# Altium schematic sheet Power.SchDoc: POWER
size A4; SheetNumber: 2; SheetTotal: 5
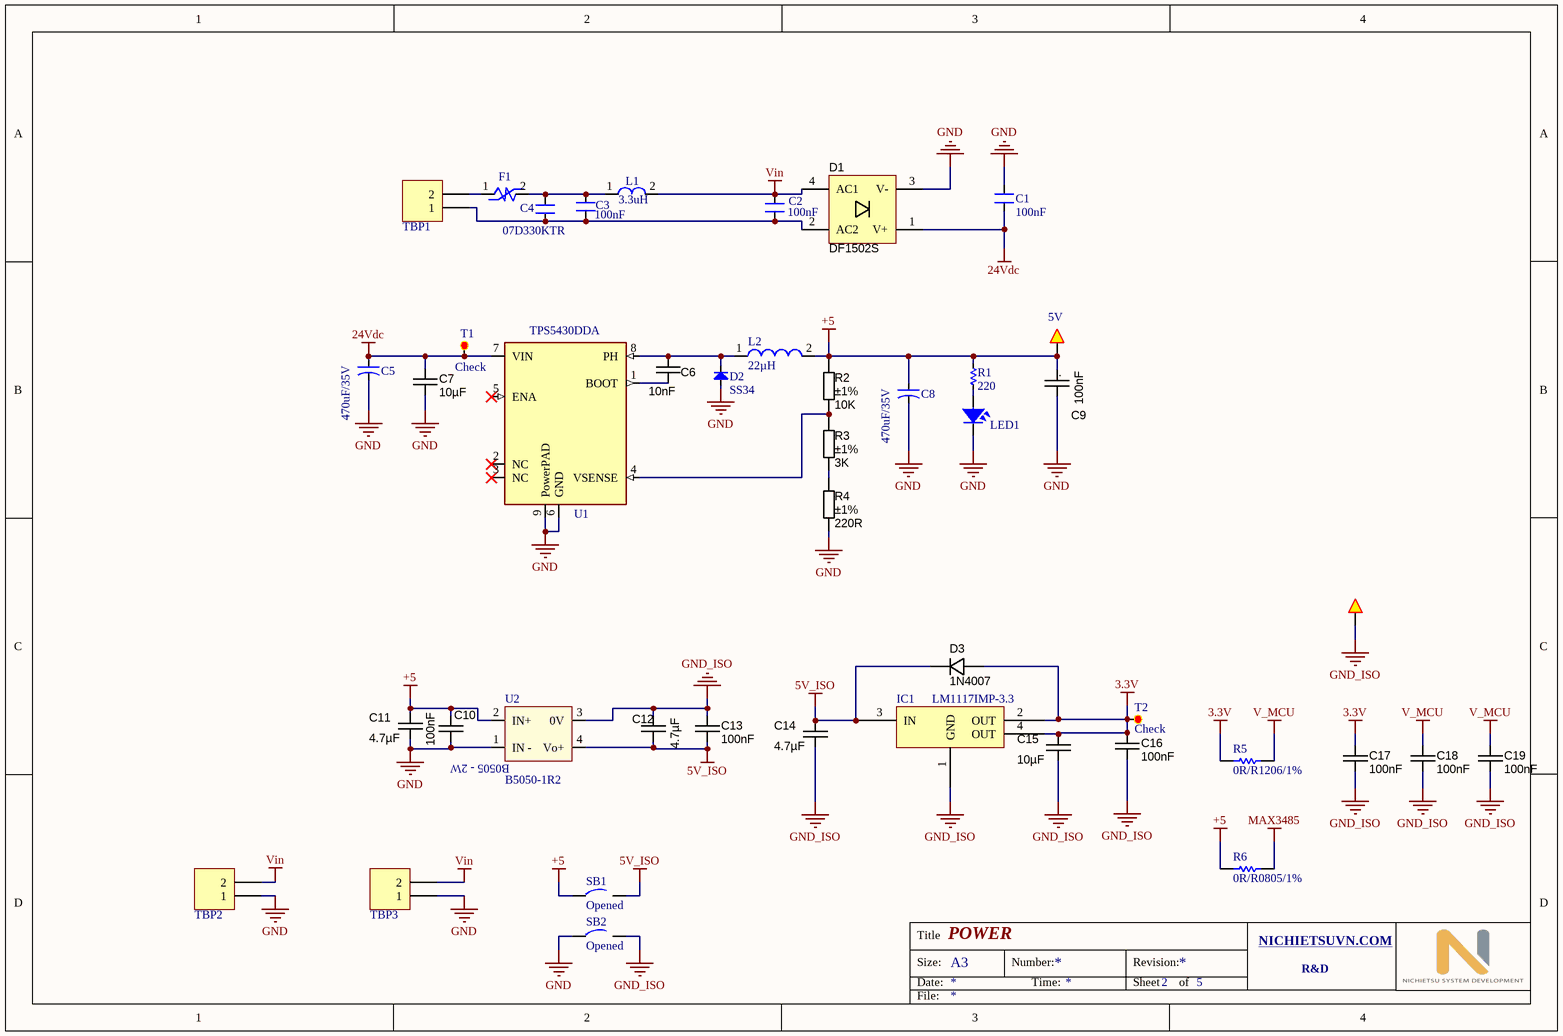
[diagram p0: Power.SchDoc]

## Parts
B1  TX1  [Test]  (value not drawn)
C1  100nF  [CN-SMD-1206]
C2  100nF  [CN-SMD-1206]
C3  100nF  [CN2.5]
C4  07D330KTR  [CN2-T]
C5  470uF/35V  [CA-ALU-6.3]
C6  10nF  [CAPC1608X90N]
C7  10µF  [CAPC2012X135N]
C8  470uF/35V  [CA-ALU-6.3]
C9  100nF  [CAPC2012X135N]
C10  100nF  [CAPC1608X90N]
C11  4.7µF  [CAPC2012X135N]
C12  4.7µF  [CAPC2012X135N]
C13  100nF  [CAPC1608X90N]
C14  4.7µF  [CAPC2012X135N]
C15  10µF  [CAPC2012X135N]
C16  100nF  [CAPC1608X90N]
C17  100nF  [CAPC1608X90N]
C18  100nF  [CAPC1608X90N]
C19  100nF  [CAPC1608X90N]
Check1  5V  [SMD-2]
D1  DF1502S  [DIODE_DF_S]
D2  SS34  [DIO-SMD-106]
D3  1N4007  [DO-214AC]
F1  RUEF185  [RUEF165]  (value not drawn)
IC1  LM1117IMP-3.3  [SOT223]
L1  3.3uH  [L-SMD-M-7.3x4.5]
L2  22µH  [IND_COIL_8D43]
LED1  LED  [LED-0805-Blue]  (value not drawn)
R1  220  [RES-SMD-0603]
R2  value 10K  Tolerance: ±1%  [RESC1608X55N]  (hidden comment: 10K_0603_1%)
R3  value 3K  Tolerance: ±1%  [RESC1608X55N]  (hidden comment: 3K_0603_0.5%)
R4  value 220R  Tolerance: ±1%  [RESC1608X55N]  (hidden comment: 220R_0603_1%)
R5  0R/R1206/1%  [R1206]
R6  0R/R0805/1%  [R0805]
SB1  Opened  [SB_0603]
SB2  Opened  [SB_0603]
T1  Check  [SMD_1.5]
T2  Check  [SMD_1.5]
TBP1  WE-Terminal Blocks Plugable Type 691322310002  [Terminal_Blocks_Pluggable_Socket__Right_Angle__3.81_mm_Pitch__2_Position]  (value not drawn)
TBP2  WE-Terminal Blocks Plugable Type 691322310002  [Terminal_Blocks_Pluggable_Socket__Right_Angle__3.81_mm_Pitch__2_Position]  (value not drawn)
TBP3  WE-Terminal Blocks Plugable Type 691322310002  [Terminal_Blocks_Pluggable_Socket__Right_Angle__3.81_mm_Pitch__2_Position]  (value not drawn)
U1  TPS5430DDA  [TPS5430]
U2  B5050-1R2  [B0505_1W]

## Nets
3.3V: C15.2 C16.1 C17.1 D3.A IC1.2(OUT) IC1.4(OUT) R5.1 T2.1
5V_ISO: C12.1 C13.2 C14.2 D3.C IC1.3(IN) SB1.2 U2.4(Vo+)
24Vdc: C1.2 C5.1 C7.2 D1.1(V+) T1.1 U1.7(VIN)
+5: C8.1 C9.1 C10.1 C11.2 Check1.1 L2.2 R1.1 R2.2 R6.1 SB1.1 U2.2(IN+)
GND: C1.1 C5.2 C7.1 C8.2 C9.2 C10.2 C11.1 D1.3(V-) D2.1(A) LED1.2 R4.1 SB2.1 TBP2.1 TBP3.1 U1.6(GND) U1.9(PowerPAD) U2.1(IN_-)
GND_ISO: B1.1 C12.2 C13.1 C14.1 C15.1 C16.2 C17.2 C18.2 C19.2 IC1.1(GND) SB2.2 U2.3(0V)
MAX3485: R6.2
V_MCU: C18.1 C19.1 R5.2
Vin: C2.2 D1.4(AC1) L1.2 TBP2.2 TBP3.2
NetC2_1: C2.1 C3.1 C4.1 D1.2(AC2) TBP1.1
NetC3_2: C3.2 C4.2 F1.2 L1.1
NetC6_1: C6.1 U1.1(BOOT)
NetC6_2: C6.2 D2.2(K) L2.1 U1.8(PH)
NetF1_1: F1.1 TBP1.2
NetLED1_1: LED1.1 R1.2
NetR2_1: R2.1 R3.2 U1.4(VSENSE)
NetR3_1: R3.1 R4.2

Not connected (* = marked no-connect by the designer): U1 2(NC)* 3(NC)* 5(ENA)*

## Notes on the sheet
- Title
- Size:
- Date:
- A3
- Number:
- Time:
- Revision:
- Sheet
- of
- NICHIETSUVN.COM <http://NICHIETSUVN.COM>
- R&D
- File:
- (in symbol B5050-1W) B0505 - 2W
- (in symbol CAPC_100nF_0805_X7R_50V_10%) .

## Library data of the parts
B1 Check1 T1 T2 = Test: WR-PHD 2.54 mm Angled Socket Header; Manufacturer: W¨¹rth Elektronik eiSos GmbH; partNo: 613002143121; ComponentLink1 Description: Manufacturer; ComponentLink2 Description: Datasheet; NoPins: 02; Created Date: 29 March 2013; ComponentLink1URL: http://www.we-online.com; ComponentLink2URL: http://katalog.we-online.de/em/datasheet/6130xx143121.pdf; Created by: Karrer Zheng
C1-C4 = CN: Value: 33pF
C5 C8 = CN-ALU-DIP: Capacitor (Semiconductor SIM Model); Value: 104; LatestRevisionDate: 17-Jul-2002; LatestRevisionNote: Re-released for DXP Platform.; PackageReference: C1206; Publisher: Altium Limited
C6 = CAPC_10000pF_0603_50V_10%: 10000pF ±10% 50V Ceramic Capacitor X7R 0603 (1608 Metric); Manufacturer 1: TDK Corporation; Manufacturer Part Number 1: CGA3E2X7R1H103K080AA; Pcs 2: 10; Tolerance: ±10%; Operating Temperature: -55°C ~ 125°C; Package / Case: 0603 (1608 Metric); Voltage - Rated: 50V; Ratings: AEC-Q200; Temperature Coefficient: X7R; Supplier Part Number 1: 445-5662-6-ND; Supplier 1: Digi-Key; Supplier 2: https://www.thegioiic.com; Supplier Part Number 2: https://www.thegioiic.com/products/tu-gom-0603-10nf-50v; Price 2: 1900; Value: 10nF
C7 = CAPC_10uF_0805_X7R_25V_10%: 10µF ±10% 25V Ceramic Capacitor X7R 1206 (3216 Metric); Manufacturer 1: Taiyo Yuden; Manufacturer Part Number: TMK316AB7106KLHT; Pcs 2: 10; Supplier 1: Digi-Key; Supplier Part Number 1: 587-3485-6-ND; Tolerance: ±10%; Operating Temperature: -55°C ~ 125°C; Package / Case: 0805 (2012 metric); Voltage - Rated: 25V; Ratings: AEC-Q200; Temperature Coefficient: X7R; Supplier 2: https://www.thegioiic.com; Supplier Part Number 2: https://www.thegioiic.com/products/tu-gom-0805-10uf-25v; Price 2: 5800; Value: 10µF
C9 = CAPC_100nF_0805_X7R_50V_10%: 0.1µF ±10% 50V Ceramic Capacitor X7R 0805 (2012 Metric); Manufacturer 1: Samsung Electro-Mechanics; Manufacturer Part Number: CL21B104KBFXPJE; Pcs 2: 10; Supplier 1: Digi-Key; Supplier Part Number 1: 1276-CL21B104KBFXPJEDKR-ND; Tolerance: ±10%; Operating Temperature: -55°C ~ 125°C; Package / Case: 0805 (2012 metric); Voltage - Rated: 50V; Ratings: AEC-Q200; Temperature Coefficient: X7R; Price 2: 2000; Supplier 2: https://www.thegioiic.com; Supplier Part Number 2: https://www.thegioiic.com/products/tu-gom-0805-100nf-0-1uf-50v; Value: 100nF
C10 C13 C16-C19 = CAPC_100nF_0603_X7R_50V_10%: 0.1µF ±10% 50V Ceramic Capacitor X7R 0603 (1608 Metric); Manufacturer 1: TDK Corporation; Manufacturer Part Number 1: CGA3E2X7R1H104K080AA; Pcs 2: 10; Supplier 1: Digi-Key; Supplier Part Number 1: 445-5666-6-ND; Tolerance: ±10%; Operating Temperature: -55°C ~ 125°C; Package / Case: 0603 (1608 Metric); Voltage - Rated: 50V; Ratings: AEC-Q200; Temperature Coefficient: X7R; Applications: Automotive; Packaging: Digi-Reel®; Supplier 2: www.thegioiic.com; Supplier Part Number 2: https://www.thegioiic.com/products/tu-gom-0603-100nf-0-1uf-50v; Price 2: 1800; Value: 100nF
C11 C12 C14 C15 = CAPC_4.7uF_0805_X7R_50V_10%: 4.7µF ±10% 50V Ceramic Capacitor X7R 0805 (2012 Metric); Manufacturer 1: TDK Corporation; Manufacturer Part Number: CGA4J1X7R1H475K125AE; Pcs 2: 1; Package / Case: 0805 (2012 metric); Tolerance: ±10%; Voltage - Rated: 50V; Temperature Coefficient: X7R; Ratings: AEC-Q200; Operating Temperature: -55°C ~ 125°C; Supplier 1: Digi-Key; Supplier Part Number 1: 445-181410-6-ND; Supplier 2: https://www.thegioiic.com; Supplier Part Number 2: https://www.thegioiic.com/products/tu-gom-0805-4-7uf-50v; Price 2: 680
  C11 C12 C14: Value: 4.7µF
  C15: Value: 10µF
D1 = DIODE_DF1502S: Bridge Rectifier Single Phase Standard 200V Surface Mount DF-S; Manufacturer 1: Diodes Incorporated; Manufacturer Part Number 1: DF1502S-T; Ratings: 200V; 1.5A; Pcs 2: 1; Package / Case: 4-SMD, Gull Wing; Diode Type: Standard; Mounting Type: Surface Mount; Supplier 1: Digi-Key; Supplier Part Number 1: DF1502SDIDKR-ND; Supplier 2: https://www.thegioiic.com; Supplier Part Number 2: https://www.thegioiic.com/products/df1502s-cau-chinh-luu-200v-1-5a; Price 2: 3500
D2 = Diode SMD: Default Diode; Code - JEDEC: DO-214-AB; Value: 1N5007; Published: 8-Jun-2000; Revision: July-2002: Re-released for DXP Platform.; Publisher: Altium Limited
D3 = DIODE_1N4007: Diode  Standard Rectifier SMD 1000V 1A SMA; Manufacturer 1: Micro Commercial Co; Manufacturer Part Number 1: SM4007PL-TP; Speed: Standard Recovery >500ns, > 200mA (Io); Ratings: 1000V; 1A; Pcs 2: 1; Package / Case: DO-214AC, SMA; Diode Type: Standard; Mounting Type: Surface Mount; Supplier 1: Digi-Key; Supplier Part Number 1: SM4007PL-TPMSDKR-ND; Supplier 2: https://www.thegioiic.com; Supplier Part Number 2: https://www.thegioiic.com/products/1n4007-m7-diode-chinh-luu-1a-1kv; Price 2: 1000
IC1 = IC_LM1117IMP-3.3: Linear Voltage Regulator IC  1 Output  800mA SOT-223; Manufacturer: Texas Instruments; Manufacturer Part Number: LM1117IMP-3.3/NOPB; Voltage - Input (Max): 15V; Voltage Dropout (Max): 1.2V @ 800mA; Protection Features: Over Current, Over Temperature; PSRR: 75dB (120Hz); Pcs 2: 1; Supplier 1: Digi-Key; Supplier Part Number 1: LM1117IMP-3.3/NOPBDKR-ND; Current - Output: 800mA; Operating Temperature: -40°C ~ 125°C; Price 2: 11000; Supplier Device Package: SOT-223; Supplier 2: https://www.thegioiic.com; Supplier Part Number 2: https://www.thegioiic.com/products/lm1117imp-3-3-nopb-ic-on-ap-3-3v-800ma
L1 = L-SMD-1: partNo: 78477010; Manufacturer: Wurth Elektronik; Inductance: 1.0 μH; ComponentLink1Description: Manufacturer; ComponentLink1URL: http://www.we-online.de; Created by: Baojun Chen; Created Date: Nov.2015; ComponentLink2Description: Datasheet; ComponentLink2URL: http://katalog.we-online.de/pbs/datasheet/78477010.pdf
L2 = INDC_SMD_22uH_8D43: 22µH Shielded Wirewound Inductor 950mA 380mOhm Max Nonstandard; Manufacturer 1: Yageo; Current Rating (Amps): 3.25 A; Ratings: None AEC-Q200; Pcs 2: 1; Supplier 1: Digi-Key; Operating Temperature: -40°C ~ 125°C; Value: 22µH; Supplier 2: https://www.thegioiic.com/; Supplier Part Number 2: https://www.thegioiic.com/products/cuon-cam-dan-smd-8d43-220-22uh-3-25a; Price 2: 2000
LED1 = LED SMD: Value: LED 3 - 5 ly 2 Colour
R1 = Res-SMD: Resistor; Manufacturer: Generic Components; Class: Passive; Published: 08/06/2000; Publisher: Altium Hobart Technology Centre
R2 = RES_10K_0603_1%: 10 kOhms ±1% 0.1W, 1/10W Chip Resistor 0603 (1608 Metric) Anti-Sulfur, Automotive AEC-Q200, Moisture Resistant Thin Film; Manufacturer: Stackpole Electronics Inc; Manufacturer Part Number: RMCF0603FT10K0; Temperature Coefficient: ±100ppm/°C; Pcs 2: 50; Package / Case: 0603 (1608 Metric); Power (Watts): 1/10W; Supplier 1: Digi-Key; Supplier Part Number 1: RMCF0603FT10K0DKR-ND; Ratings: Automotive AEC-Q200; Operating Temperature: -55°C ~ 155°C; Supplier 2: www.thegioiic.com; Supplier Part Number 2: https://www.thegioiic.com/products/dien-tro-10-kohm-0603-1; Price 2: 2000
R3 = RES_3K_0603_1%: 3 kOhms ±1% 0.1W, 1/10W Chip Resistor 0603 (1608 Metric) Automotive AEC-Q200 Thick Film; Manufacturer: Stackpole Electronics Inc; Manufacturer Part Number: RMCF0603FT3K00; Temperature Coefficient: ±100ppm/°C; Pcs 2: 50; Package / Case: 0603 (1608 Metric); Power (Watts): 1/10W; Supplier 1: Digi-Key; Supplier Part Number 1: RMCF0603FT3K00DKR-ND; Ratings: AEC-Q200; Supplier Part Number 2: https://www.thegioiic.com/products/dien-tro-3-kohm-0603-1; Supplier 2: www.thegioiic.com; Operating Temperature: -55°C ~ 155°C; Price 2: 2000
R4 = RES_220R_0603_1%: 220 Ohms ±1% 0.1W, 1/10W Chip Resistor 0603 (1608 Metric) Automotive AEC-Q200 Thick Film; Manufacturer: Stackpole Electronics Inc; Manufacturer Part Number: RMCF0603FT220R; Temperature Coefficient: ±100ppm/°C; Pcs 2: 50; Package / Case: 0603 (1608 Metric); Ratings: AEC-Q200; Supplier 1: Digi-Key; Supplier Part Number 1: RMCF0603FT220RDKR-ND; Power (Watts): 0.1W, 1/10W; Operating Temperature: -55°C ~ 155°C; Composition: Thick Film; Supplier 2: www.thegioiic.com; Supplier Part Number 2: https://www.thegioiic.com/products/dien-tro-220-ohm-0603-1; Price 2: 2000
R5 = RES_0R/R1206/1%: RES SMD 0.0 OHM JUMPER 1/4W 1206; Manufacturer: Bourns Inc.; Manufacturer Part Number: CR1206-J/-000ELF; Resistance (Ohms): 0.0; Power (Watts): 0.25W, 1/4W; Temperature Coefficient: -250/ +500ppm/°C; Supplier 1: Digi-Key; RoHS: RoHS Compliant By Exemption; Category: Resistors; Stock 1: 80000; Pricing 1: 5000=0.00931, 10000=0.00809, 25000=0.00711, 50000=0.00652, 125000=0.00638 (USD); Packaging: Tape & Reel (TR); Tolerance: Jumper; Composition: Thick Film; Features: Moisture Resistant; Operating Temperature: -55°C ~ 155°C; Package / Case: 1206 (3216 Metric); Supplier Device Package: 1206; Size / Dimension: 0.126" L x 0.063" W (3.20mm x 1.60mm); Height: 0.030" (0.75mm); Number of Terminations: 2; ComponentLink1URL: http://www.bourns.com/data/global/pdfs/CHPREZTR.pdf; ComponentLink1Description: http://www.bourns.com/data/global/pdfs/CHPREZTR.pdf; Supplier Part Number 1: CR1206-J/-000ELFTR-ND
R6 = RES_0R/R0805/1%_1: RES SMD 0.0 OHM JUMPER 1/8W 0805; Manufacturer: Bourns Inc.; Manufacturer Part Number: CR0805-J/-000ELF; Resistance (Ohms): 0.0; Power (Watts): 0.125W, 1/8W; Temperature Coefficient: -250/ +500ppm/°C; Supplier 1: Digi-Key; RoHS: RoHS Compliant By Exemption; Category: Resistors; Stock 1: 50000; Pricing 1: 5000=0.00741, 10000=0.00644, 25000=0.00566, 50000=0.00519, 125000=0.00508 (USD); Packaging: Tape & Reel (TR); Tolerance: Jumper; Composition: Thick Film; Features: Moisture Resistant; Operating Temperature: -55°C ~ 155°C; Package / Case: 0805 (2012 Metric); Supplier Device Package: 0805; Size / Dimension: 0.079" L x 0.049" W (2.00mm x 1.25mm); Height: 0.024" (0.60mm); Number of Terminations: 2; ComponentLink1URL: http://www.bourns.com/data/global/pdfs/CHPREZTR.pdf; ComponentLink1Description: http://www.bourns.com/data/global/pdfs/CHPREZTR.pdf; Supplier Part Number 1: CR0805-J/-000ELFTR-ND
SB1 SB2 = CircuitBreakerOpen: Circuit Breaker; Published: 24-Mar-1999; Revision: July-2002: Re-released for DXP Platform.; Publisher: Altium Limited
TBP1-TBP3 = Terminal_Blocks_Pluggable_Socket__Right_Angle__3.81_mm_Pitch__2_Position: WR-TBL Terminal block - serie 322 - 3.81 mm; Manufacturer 1: W¨¹rth Elektronik eiSos GmbH; ComponentLink1 Description: Manufacturer; ComponentLink2 Description: Datasheet; NoPins: 02; Pcs 2: 1; ComponentLink1URL: http://www.we-online.com; ComponentLink2URL: http://katalog.we-online.de/em/datasheet/6913223100xx.pdf; Supplier 1: Digi-Key; Supplier Part Number 1: *; Supplier 2: https://www.thegioiic.com; Manufacturer Part Number 1: 691322310002; Supplier Part Number 2: https://www.thegioiic.com/products/kf-3-81-2-r-terminal-block-plug-in-han-pcb-2-chan-cong-3-81mm; Price 2: 2000
U2 = B5050-1W